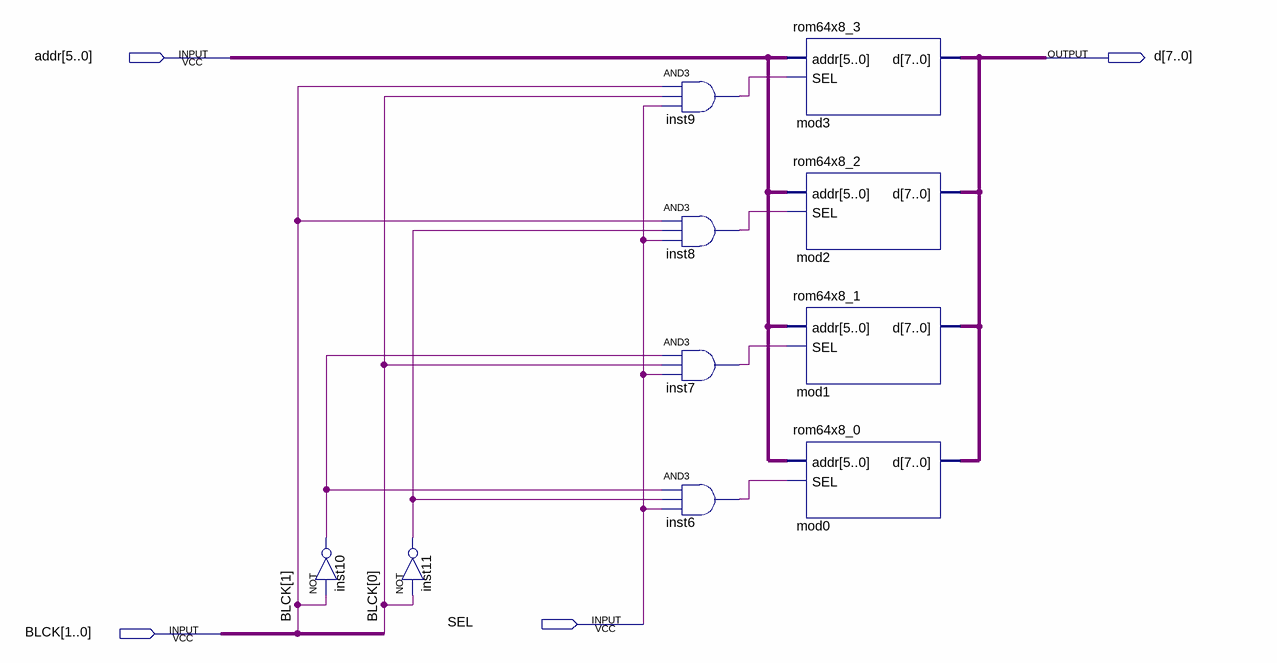
[diagram p0: schematic sheet]
// Quartus schematic rom_4blocks.bdf as structural Verilog: 10 symbols, 4 pins
module rom_4blocks (
  input  [5:0] addr,
  input  SEL,
  input  [1:0] BLCK,
  output [7:0] d
);

  wire inst6_out, inst7_out, inst8_out, inst9_out, inst10_out, inst11_out;

  not inst10 (inst10_out, BLCK[1]);
  not inst11 (inst11_out, BLCK[0]);
  and inst9 (inst9_out, BLCK[1], BLCK[0], SEL);
  and inst8 (inst8_out, BLCK[1], inst11_out, SEL);
  and inst7 (inst7_out, inst10_out, BLCK[0], SEL);
  and inst6 (inst6_out, inst10_out, inst11_out, SEL);
  rom64x8_3 mod3 (.addr(addr), .SEL(inst9_out), .d(d));
  rom64x8_2 mod2 (.addr(addr), .SEL(inst8_out), .d(d));
  rom64x8_1 mod1 (.addr(addr), .SEL(inst7_out), .d(d));
  rom64x8_0 mod0 (.addr(addr), .SEL(inst6_out), .d(d));
endmodule
